# EAGLE design LoRaBee (EAGLE 9.6.2)
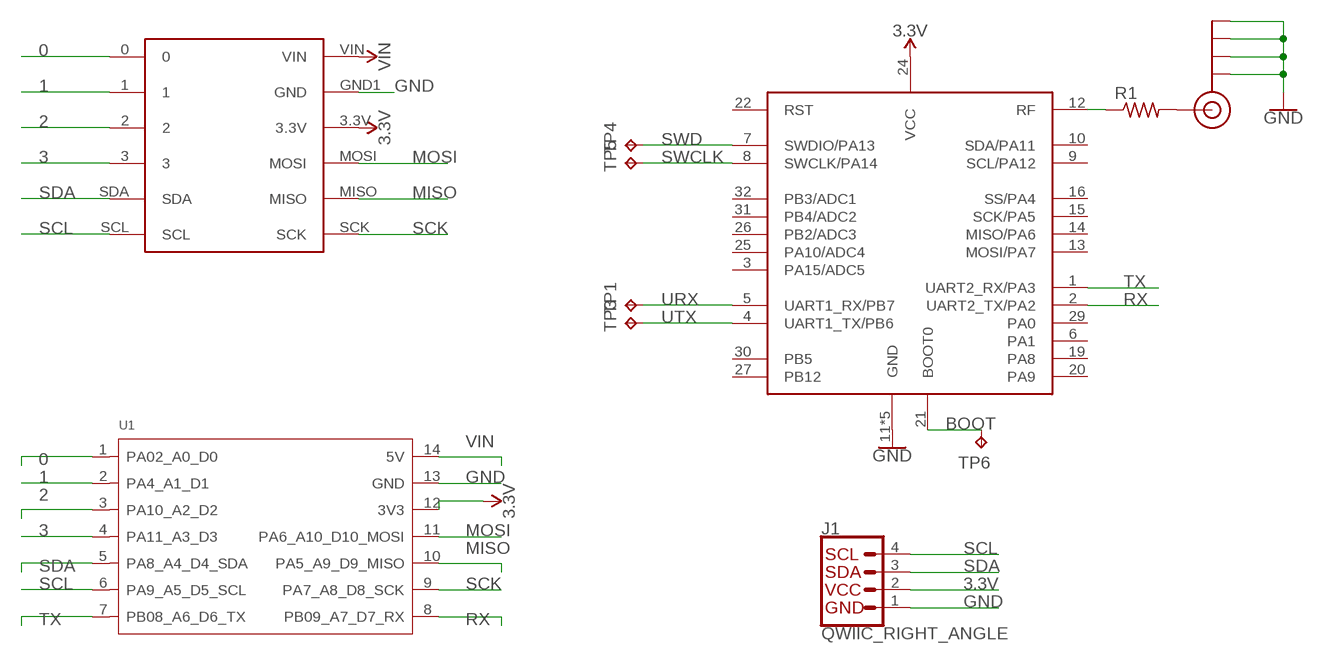
[diagram p0: schematic, sheet 1]

## Parts
J1  QWIIC_RIGHT_ANGLE  QWIIC_CONNECTORJS-1MM  [JST04_1MM_RA]
J$1  SMA_EDGE  [SMA-EDGE]
R1  R-US_R0805  [R0805]
TP1  TPTP12R  [TP12R]
TP3  TPTP12R  [TP12R]
TP4  TPTP12R  [TP12R]
TP5  TPTP12R  [TP12R]
TP6  TPTP12R  [TP12R]
U1  MOUDLE-SEEEDUINO-XIAO  [MOUDLE14P-2.54-21X17.8MM]
U$1  BEEELINK  [BEEELINK]
U$2  RAK3172HF  [RAK3172]

## Nets
0: U1.1(PA02_A0_D0) U$1.0
1: U1.2(PA4_A1_D1) U$1.1
2: U1.3(PA10_A2_D2) U$1.2
3: U1.4(PA11_A3_D3) U$1.3
3.3V: J1.2 U1.12(3V3) U$1.3.3V U$2.24(VCC)
BOOT: TP6.TP U$2.21(BOOT0)
GND: J1.1 J$1.GND@0(GND) J$1.GND@1(GND) J$1.GND@2(GND) J$1.GND@3(GND) U1.13(GND) U$1.GND1(GND) U$2.11(GND) U$2.17(GND) U$2.18(GND) U$2.23(GND) U$2.28(GND)
MISO: U1.10(PA5_A9_D9_MISO) U$1.MISO
MOSI: U1.11(PA6_A10_D10_MOSI) U$1.MOSI
N$1: R1.1 U$2.12(RF)
N$2: J$1.SIG(SIGNAL) R1.2
RX: U1.8(PB09_A7_D7_RX) U$2.2(UART2_TX/PA2)
SCK: U1.9(PA7_A8_D8_SCK) U$1.SCK
SCL: J1.4 U1.6(PA9_A5_D5_SCL) U$1.SCL
SDA: J1.3 U1.5(PA8_A4_D4_SDA) U$1.SDA
SWCLK: TP5.TP U$2.8(SWCLK/PA14)
SWD: TP4.TP U$2.7(SWDIO/PA13)
TX: U1.7(PB08_A6_D6_TX) U$2.1(UART2_RX/PA3)
URX: TP1.TP U$2.5(UART1_RX/PB7)
UTX: TP3.TP U$2.4(UART1_TX/PB6)
VIN: U1.14(5V) U$1.VIN
Unconnected: U$2.3(PA15/ADC5) U$2.6(PA1) U$2.9(SCL/PA12) U$2.10(SDA/PA11) U$2.13(MOSI/PA7) U$2.14(MISO/PA6) U$2.15(SCK/PA5) U$2.16(SS/PA4) U$2.19(PA8) U$2.20(PA9) U$2.22(RST) U$2.25(PA10/ADC4) U$2.26(PB2/ADC3) U$2.27(PB12) U$2.29(PA0) U$2.30(PB5) U$2.31(PB4/ADC2) U$2.32(PB3/ADC1)

## Library data of the parts
J1 = SparkFun-Connectors:QWIIC_CONNECTOR: SparkFun I2C Standard Qwiic Connector An SMD 1mm pitch JST connector makes it easy and quick (get it? Qwiic?) to connect I2C devices to each other. The Qwiic system <http://www.sparkfun.com/qwiic> enables fast and solderless connection between popular platforms and various sensors and actuators. We carry 200mm <https://www.sparkfun.com/products/14204>, 100mm <https://www.sparkfun.com/products/14205>, 50mm <https://www.sparkfun.com/products/14206>, and breadboard friendly <https://www.sparkfun.com/products/14207> Qwiic cables. We also offer 10 pcs strips <https://www.sparkfun.com/products/14323> the SMD connectors.; PROD_ID: CONN-13694
J$1 = SparkFun-Retired:SMA_EDGE: SMA Antenna Connector End launch SMA connector. The paste layer has been removed so that the connector can be hand soldered onto the board after reflow.
R1 = resistor:R-US_: RESISTOR, American symbol
TP1 TP3-TP6 = testpad:TP: Test pad
U1 = Seeeduino XIAO:MOUDLE-SEEEDUINO-XIAO
U$1 = BeeeLink V1:BEEELINK
U$2 = RAK3172-Breakout:RAK3172: RAK4260 LoRaWAN module from RAKwireless.

## Board
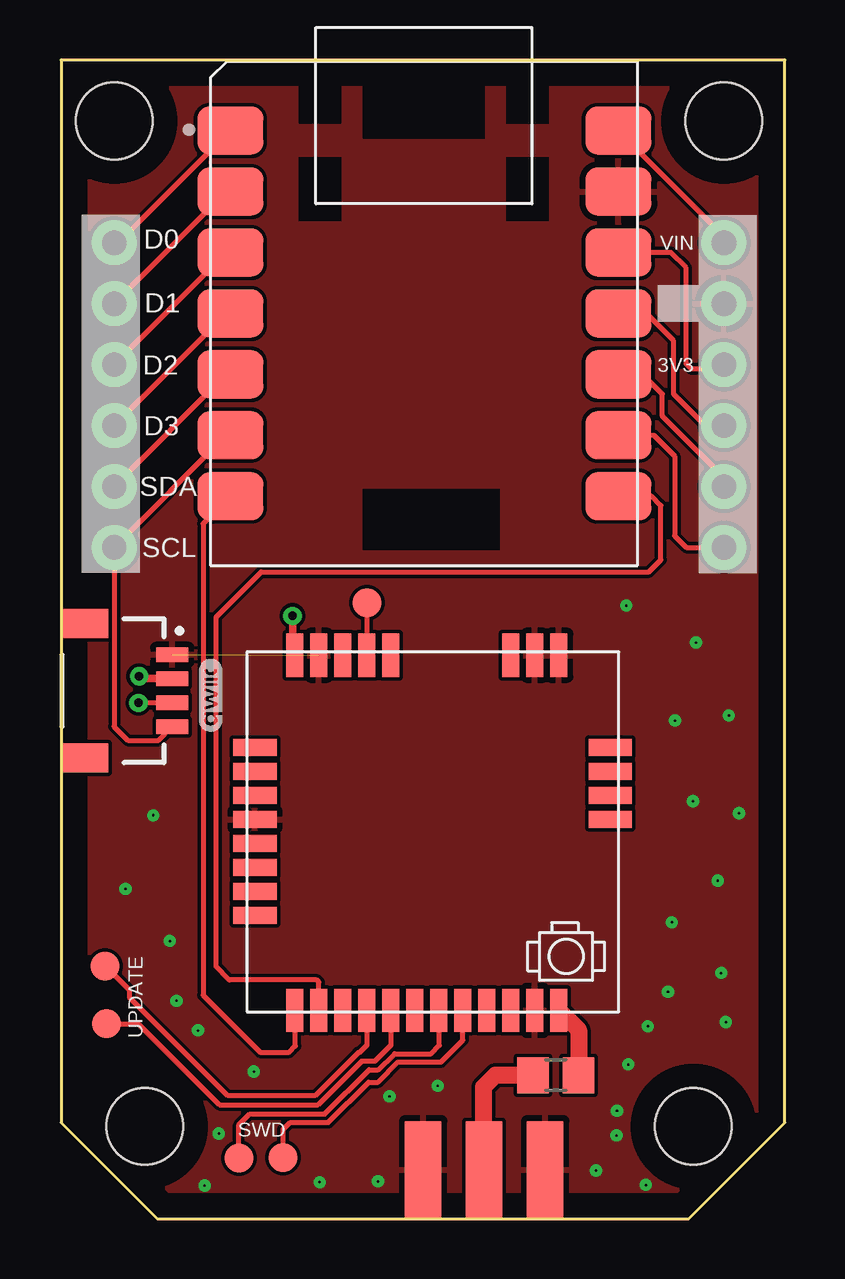
[diagram p1: board, top side]
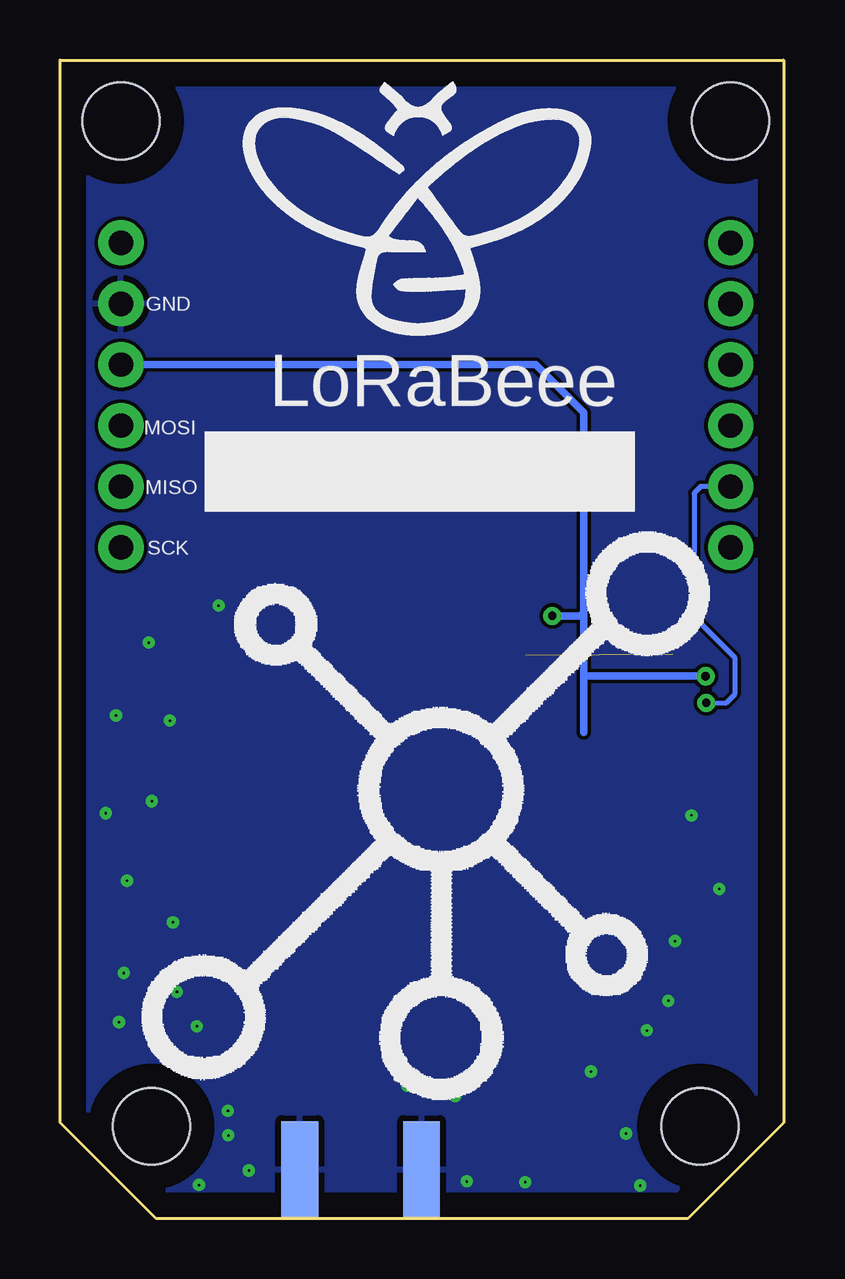
[diagram p2: board, bottom side, seen from below]

Size 30.15 x 48.3 mm. Coordinates in mm from the lower left corner, seen from the top.
Copper layers (1*16): Top 0.035mm / dielectric 1.5mm / Bottom 0.035mm
Design rules "default": minimum track width 6mil, minimum drill 0.35mm, track to track 6mil, track to pad 6mil, pad to pad 6mil, via to via 6mil, smd to smd 6mil, copper to edge 40mil, drill to drill 6mil, minimum pad ring 10mil, minimum via ring 8mil, stop-mask expansion 4mil, vias tented up to drill 0mil, thermal gap 10mil

### Footprints (pad centres in the part's own frame; a part is rotated, then mirrored left to right if it is on the bottom)
JST04_1MM_RA = smd 0.6 x 1.35: 1 -1.5,0; 2 -0.5,0; 3 0.5,0; 4 1.5,0 | smd 1.2 x 2: NC1 2.8,-3.675; NC2 -2.8,-3.675
SMA-EDGE = smd 1.524 x 4.064: GND@0 0,0; GND@1 5.08,0; SIG 2.54,0 | smd 1.524 x 4.064 bottom: GND@2 0,0; GND@3 5.08,0
R0805 = smd 1.3 x 1.5: 1 -0.95,0; 2 0.95,0
TP12R = smd 1.2 x 1.2: TP 0,0
MOUDLE14P-2.54-21X17.8MM = smd 2.75 x 2: 1 0.835,18.12; 2 0.835,15.58; 3 0.835,13.04; 4 0.835,10.5; 5 0.835,7.96; 6 0.835,5.42; 7 0.835,2.88; 8 17,2.88; 9 17,5.42; 10 17,7.96; 11 17,10.5; 12 17,13.04; 13 17,15.58; 14 17,18.12
BEEELINK = drill 1.016 pad 1.88: 0 29.21,39.37; 1 29.21,36.83; 2 29.21,34.29; 3 29.21,31.75; 3.3V 54.61,34.29; GND1 54.61,36.83; MISO 54.61,29.21; MOSI 54.61,31.75; SCK 54.61,26.67; SCL 29.21,26.67; SDA 29.21,29.21; VIN 54.61,39.37 | hole 3.2: 29.21,44.45; 54.61,44.45; 30.48,2.54; 53.34,2.54
RAK3172 = smd 0.7 x 1.8: 1 13.5,14.945; 2 12.5,14.945; 3 11.5,14.945; 4 10.5,14.945; 5 9.5,14.945; 6 8.5,14.945; 7 7.5,14.945; 8 6.5,14.945; 9 5.5,14.945; 10 4.5,14.945; 11 3.5,14.945; 12 2.5,14.945; 17 2.5,0.145; 18 3.5,0.145; 19 4.5,0.145; 20 9.5,0.145; 21 10.5,0.145; 22 11.5,0.145; 23 12.5,0.145; 24 13.5,0.145 | smd 1.8 x 0.7: 13 0.365,6.99; 14 0.365,5.99; 15 0.365,4.99; 16 0.365,3.99; 25 15.165,3.99; 26 15.165,4.99; 27 15.165,5.99; 28 15.165,6.99; 29 15.165,7.99; 30 15.165,8.99; 31 15.165,9.99; 32 15.165,10.99

### Placement (x,y rotation side)
J1  4.63,22.01 270 top
J$1  15.08,2.03 0 top
R1  20.61,5.98 180 top
TP1  1.9,8.13 0 top
TP3  1.83,10.53 0 top
TP4  7.4,2.53 0 top
TP5  9.25,2.54 0 top
TP6  12.74,25.67 0 top
U1  6.22,27.23 0 top
U$1  -27,1.31 0 top
U$2  23.24,23.63 180 top
U$3  [LOGO]  26.73,4.99 0 bottom
U$4  [BEEE_LOGO_M]  22.92,34.42 0 bottom
U$5  [QWIIC_3MM]  6.23,21.81 90 top

### Tracks (layer width: path | path; a pad name or v marks a point on that pad's centre or on a via)
0
  Top 0.2: U1.1 2.38,40.68 U$1.0
1
  Top 0.2: U$1.1 6.89,42.81 U1.2
2
  Top 0.2: U$1.2 6.56,39.95 6.56,40.46 6.87,40.46 U1.3
3
  Top 0.2: U$1.3 6.54,37.39 6.54,38.05 6.73,38.05 U1.4
3.3V  (via drill 0.35)
  Top 0.2: U$1.3.3V 27.43,35.41 26.26,35.41 26.04,35.64 26.04,39.64 25.41,40.27 U1.12
  Top 0.305: v9.64,25.12 9.64,23.58 U$2.24 | v3.25,22.61 3.35,22.51 J1.2
  Bottom 0.305: U$1.3.3V 10.32,35.6 8.33,33.61 8.33,25.26 | 8.33,25.26 8.33,22.59 | 8.33,22.59 8.33,20.27 | 8.33,25.26 8.47,25.12 v9.64,25.12 | v3.25,22.61 8.31,22.61 8.33,22.59
BOOT
  Top 0.2: TP6.TP U$2.21
GND  (via drill 0.1)  (1 unrouted)
  other vias: 8.03,6.13 5.7,7.84 24.45,8.02 23.16,4.49 10.77,1.52 5.97,1.38 22.28,2.01 25.44,12.35 4.8,9.08 15.69,5.54 23.63,6.43 26.32,17.4 27.5,10.24 27.69,8.2 27.36,14.09 6.57,3.55 13.2,1.55 13.68,5.1 24.36,1.41 23.14,3.47 4.53,11.57 2.68,13.74 3.84,16.81 23.54,25.55 25.57,20.76 26.45,24.01 27.82,20.98 28.24,16.9 25.28,9.45
  pour Top: 0.18,48.12 29.93,48.12 30,48.05 30,4.39 25.74,0.14 4.34,0.14 0.16,4.31 0.16,48.11 0.17,48.12
  pour Bottom: 0.25,48.02 29.99,48.02 29.99,48.02 29.99,4.04 26.1,0.15 4.27,0.15 0.1,4.32 0.1,47.9 0.23,48.02
MISO
  Top 0.2: U$1.MISO 27.61,30.88 25.05,33.45 25.05,34.38 24.13,35.29 23.32,35.29 U1.10
MOSI
  Top 0.2: U$1.MOSI 27.57,33.01 26.88,33.01 25.52,34.38 25.52,36.6 24.24,37.88 23.37,37.88 U1.11
N$1
  Top 0.7: U$2.12 21.56,7.86 R1.1
N$2
  Top 0.7: R1.2 18.09,5.98 17.59,5.48 17.59,2.06 J$1.SIG
RX
  Top 0.2: U$2.2 10.74,9.86 10.65,9.95 7.01,9.95 6.45,10.51 6.45,25.07 8.33,26.96 24.49,26.96 24.99,27.46 24.99,29.73 24.6,30.11 U1.8
SCK
  Top 0.2: U1.9 24.69,32.65 25.56,31.78 25.56,28.46 26.05,27.98 U$1.SCK
SCL
  Top 0.2: U1.6 6.89,32.65 U$1.SCL 2.21,20.54 2.2,20.52 2.78,19.94 4.06,19.94 J1.4
  Top 0.305: U$1.SCL 2.45,27.74
SDA  (via drill 0.35)
  Top 0.2: U$1.SDA 6.89,35.19 U1.5 | v3.22,21.5 v3.23,21.51 J1.3
  Bottom 0.2: U$1.SDA 3.45,30.52 3.73,30.24 3.73,25.08 2.04,23.39 2.04,21.85 2.41,21.48 3.21,21.48 v3.22,21.5
SWCLK
  Top 0.2: TP5.TP 9.25,3.72 9.54,4.01 11.13,4.01 12.81,5.69 13.2,5.69 14.04,6.53 15.83,6.53 16.74,7.44 U$2.8
SWD
  Top 0.2: TP4.TP 7.4,3.91 7.86,4.37 10.99,4.37 12.83,6.21 13.22,6.21 13.89,6.88 15.42,6.88 15.76,7.22 15.76,8.66 U$2.7
TX
  Top 0.2: U1.7 5.91,28.97 5.91,9.32 8.29,6.94 9.51,6.94 9.76,7.2 9.76,8.66 U$2.1
URX
  Top 0.2: TP1.TP 3.21,8.13 6.59,4.75 10.71,4.75 12.52,6.56 13.07,6.56 13.74,7.23 U$2.5
UTX
  Top 0.2: U$2.4 12.74,7.22 12.43,6.91 12.38,6.91 10.58,5.12 6.94,5.12 2.85,9.21 2.85,9.51 TP3.TP
VIN
  Top 0.2: U1.14 27.61,40.96 U$1.VIN

### Text on the board
tNames: D0 | VIN | D1 | 3V3 | D2 | D3 | SDA | SCL | UPDATE | SWD
bNames: GND | LoRaBeee | MOSI | MISO | SCK